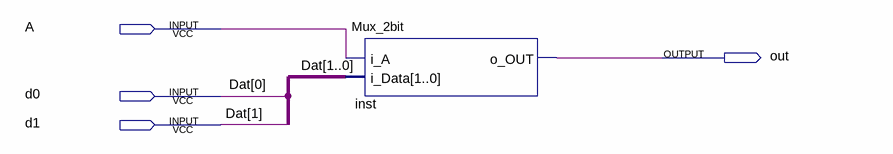
[diagram p0: schematic sheet]
// Quartus schematic Mux_2bit_schematic.bdf as structural Verilog: 1 symbols, 4 pins
module Mux_2bit_schematic (
  input  A,
  input  d0,
  input  d1,
  output out
);

  Mux_2bit inst (.i_A(A), .i_Data({d1, d0}), .o_OUT(out));

  // Other names for the same wires on the sheet: Dat[1:0] = {d1, d0}
endmodule
